# Altium schematic sheet buttons.SchDoc: Title
size B; Organization: Midnight Sun Solar Rayce Car Team; Address1: University of Waterloo; Address2: 200 University Ave W; Address3: Waterloo, ON, Canada; Address4: N2L 3E9; Website: www.uwmidsun.com; ProjectName: ProjectName
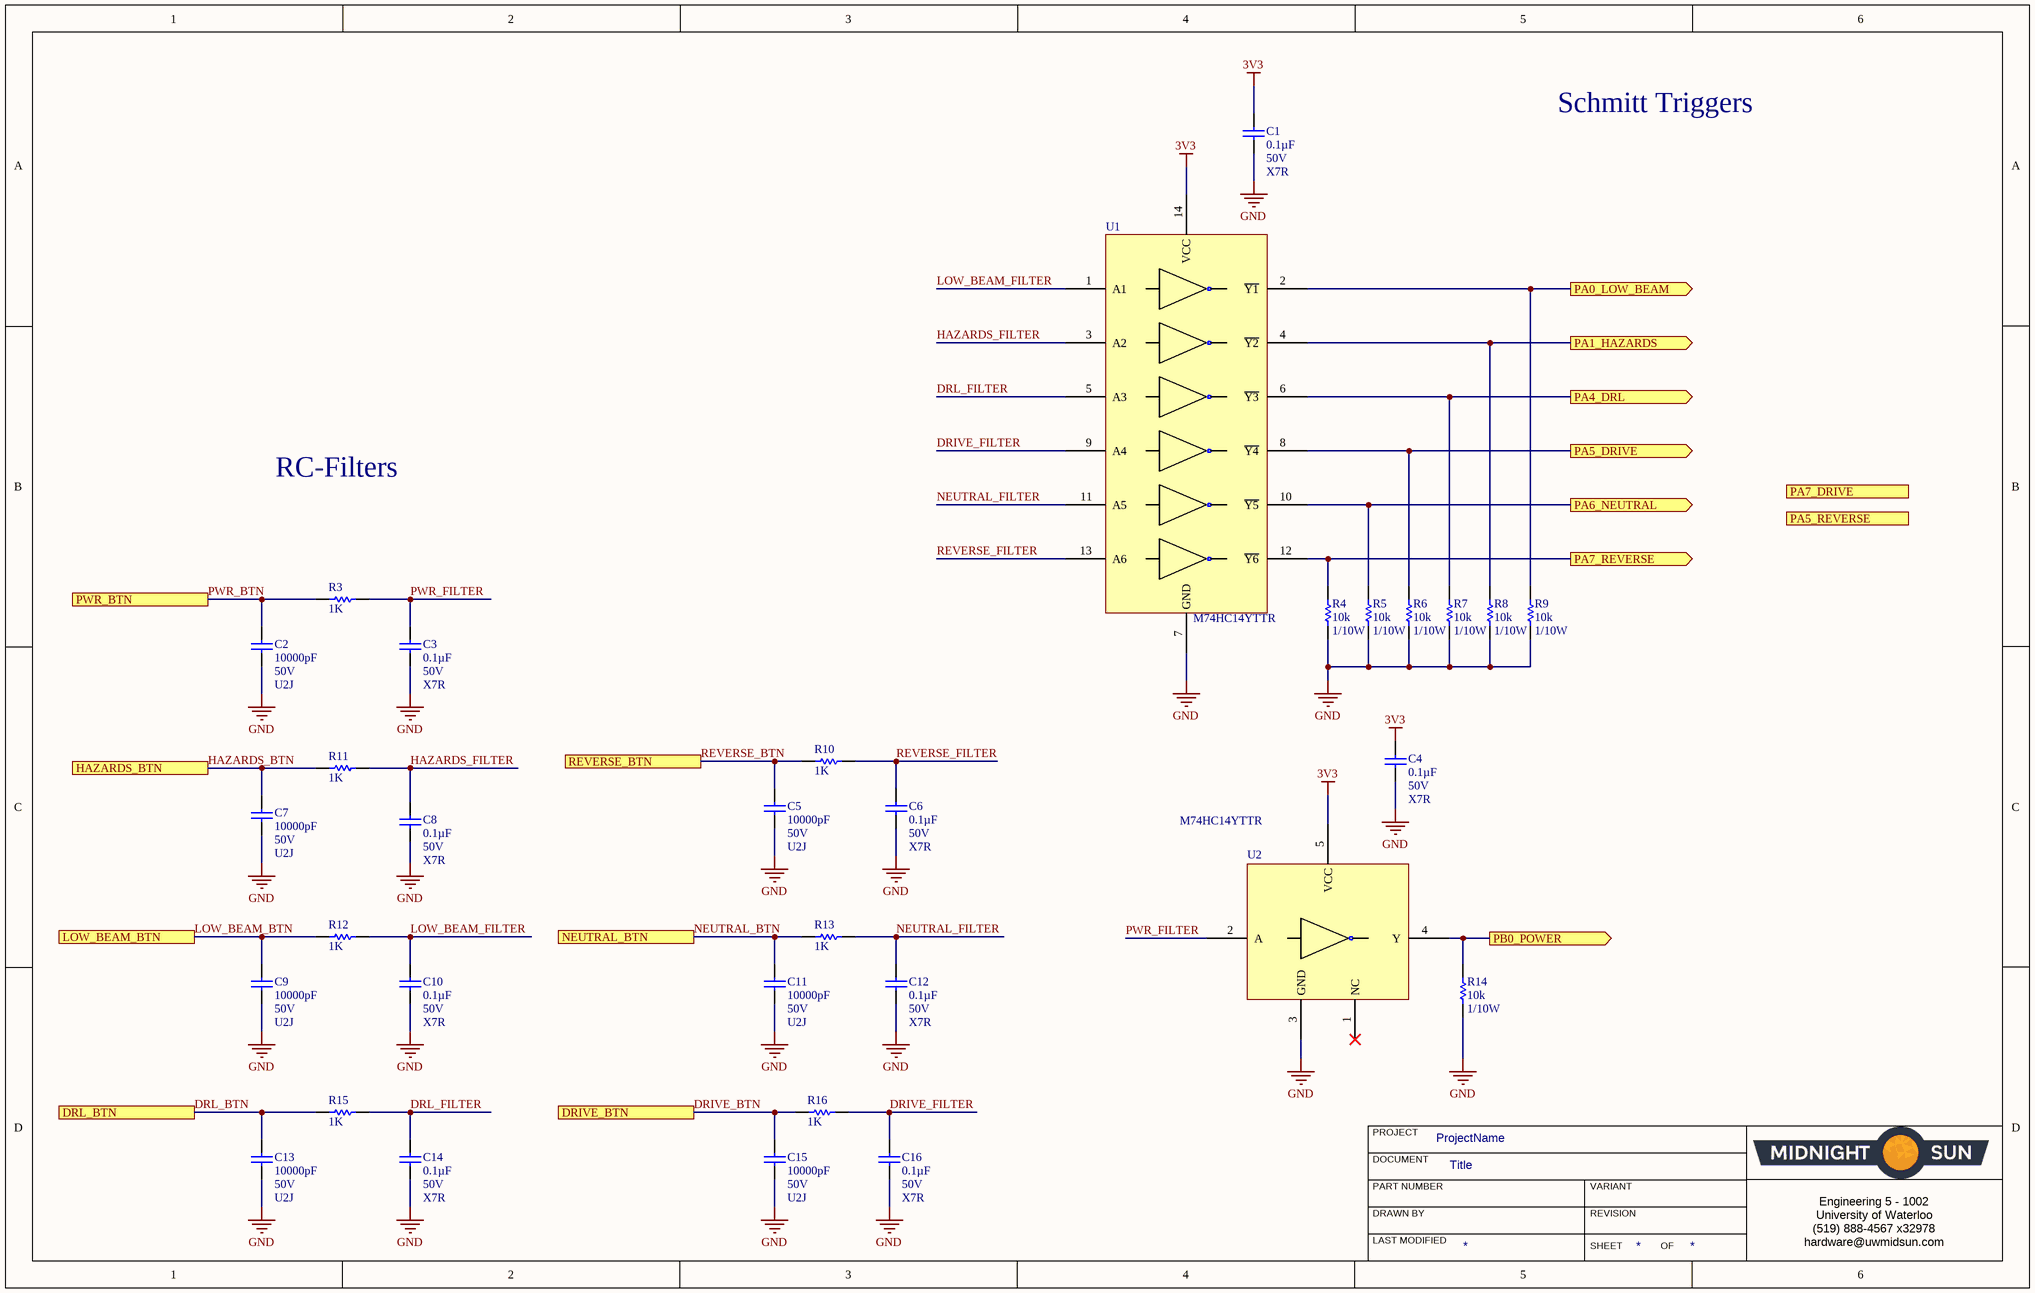
[diagram p0: buttons.SchDoc]

## Parts
C1  Capacitance: 0.1µF  Voltage: 50V  Temperature Coefficient: X7R  [CAP, 0603]  (hidden comment: CAP CER 0.1UF 50V 10% X7R 0603)
C2  Capacitance: 10000pF  Voltage: 50V  Temperature Coefficient: U2J  [CAP, 0603]  (hidden comment: CAP CER 10nF 50V 5% X7R 0603)
C3  Capacitance: 0.1µF  Voltage: 50V  Temperature Coefficient: X7R  [CAP, 0603]  (hidden comment: CAP CER 0.1UF 50V 10% X7R 0603)
C4  Capacitance: 0.1µF  Voltage: 50V  Temperature Coefficient: X7R  [CAP, 0603]  (hidden comment: CAP CER 0.1UF 50V 10% X7R 0603)
C5  Capacitance: 10000pF  Voltage: 50V  Temperature Coefficient: U2J  [CAP, 0603]  (hidden comment: CAP CER 10nF 50V 5% X7R 0603)
C6  Capacitance: 0.1µF  Voltage: 50V  Temperature Coefficient: X7R  [CAP, 0603]  (hidden comment: CAP CER 0.1UF 50V 10% X7R 0603)
C7  Capacitance: 10000pF  Voltage: 50V  Temperature Coefficient: U2J  [CAP, 0603]  (hidden comment: CAP CER 10nF 50V 5% X7R 0603)
C8  Capacitance: 0.1µF  Voltage: 50V  Temperature Coefficient: X7R  [CAP, 0603]  (hidden comment: CAP CER 0.1UF 50V 10% X7R 0603)
C9  Capacitance: 10000pF  Voltage: 50V  Temperature Coefficient: U2J  [CAP, 0603]  (hidden comment: CAP CER 10nF 50V 5% X7R 0603)
C10  Capacitance: 0.1µF  Voltage: 50V  Temperature Coefficient: X7R  [CAP, 0603]  (hidden comment: CAP CER 0.1UF 50V 10% X7R 0603)
C11  Capacitance: 10000pF  Voltage: 50V  Temperature Coefficient: U2J  [CAP, 0603]  (hidden comment: CAP CER 10nF 50V 5% X7R 0603)
C12  Capacitance: 0.1µF  Voltage: 50V  Temperature Coefficient: X7R  [CAP, 0603]  (hidden comment: CAP CER 0.1UF 50V 10% X7R 0603)
C13  Capacitance: 10000pF  Voltage: 50V  Temperature Coefficient: U2J  [CAP, 0603]  (hidden comment: CAP CER 10nF 50V 5% X7R 0603)
C14  Capacitance: 0.1µF  Voltage: 50V  Temperature Coefficient: X7R  [CAP, 0603]  (hidden comment: CAP CER 0.1UF 50V 10% X7R 0603)
C15  Capacitance: 10000pF  Voltage: 50V  Temperature Coefficient: U2J  [CAP, 0603]  (hidden comment: CAP CER 10nF 50V 5% X7R 0603)
C16  Capacitance: 0.1µF  Voltage: 50V  Temperature Coefficient: X7R  [CAP, 0603]  (hidden comment: CAP CER 0.1UF 50V 10% X7R 0603)
R3  1K  [RES, 0603]
R4  Resistance: 10k  Power: 1/10W  [RES, 0603]  (hidden comment: RES 10K OHM 1% 1/10W 0603)
R5  Resistance: 10k  Power: 1/10W  [RES, 0603]  (hidden comment: RES 10K OHM 1% 1/10W 0603)
R6  Resistance: 10k  Power: 1/10W  [RES, 0603]  (hidden comment: RES 10K OHM 1% 1/10W 0603)
R7  Resistance: 10k  Power: 1/10W  [RES, 0603]  (hidden comment: RES 10K OHM 1% 1/10W 0603)
R8  Resistance: 10k  Power: 1/10W  [RES, 0603]  (hidden comment: RES 10K OHM 1% 1/10W 0603)
R9  Resistance: 10k  Power: 1/10W  [RES, 0603]  (hidden comment: RES 10K OHM 1% 1/10W 0603)
R10  1K  [RES, 0603]
R11  1K  [RES, 0603]
R12  1K  [RES, 0603]
R13  1K  [RES, 0603]
R14  Resistance: 10k  Power: 1/10W  [RES, 0603]  (hidden comment: RES 10K OHM 1% 1/10W 0603)
R15  1K  [RES, 0603]
R16  1K  [RES, 0603]
U1  Manufacturer Part Number: M74HC14YTTR  [IC INVERTER SCHMITT 6CH 14TSSOP]  (hidden comment: IC INVERTER SCHMITT 6CH 14TSSOP)
U2  Manufacturer Part Number: M74HC14YTTR  [IC INVERTER SCHMITT 1CH SC70-5]  (hidden comment: IC INVERTER SCHMITT 1CH SC70-5)

## Ports
DRIVE_BTN, DRL_BTN, HAZARDS_BTN, LOW_BEAM_BTN, NEUTRAL_BTN, PA0_LOW_BEAM (out), PA1_HAZARDS (out), PA4_DRL (out), PA5_DRIVE (out), PA5_REVERSE (in), PA6_NEUTRAL (out), PA7_DRIVE (in), PA7_REVERSE (out), PB0_POWER (out), PWR_BTN, REVERSE_BTN

## Nets
3V3: C1.1 C4.1 U1.14(VCC) U2.5(VCC)
GND: C1.2 C2.2 C3.2 C4.2 C5.2 C6.2 C7.2 C8.2 C9.2 C10.2 C11.2 C12.2 C13.2 C14.2 C15.2 C16.2 R4.2 R5.2 R6.2 R7.2 R8.2 R9.2 R14.2 U1.7(GND) U2.3(GND)
DRIVE_BTN: C15.1 R16.1 ; port DRIVE_BTN
DRIVE_FILTER: C16.1 R16.2 U1.9(A4)
DRL_BTN: C13.1 R15.1 ; port DRL_BTN
DRL_FILTER: C14.1 R15.2 U1.5(A3)
HAZARDS_BTN: C7.1 R11.1 ; port HAZARDS_BTN
HAZARDS_FILTER: C8.1 R11.2 U1.3(A2)
LOW_BEAM_BTN: C9.1 R12.1 ; port LOW_BEAM_BTN
LOW_BEAM_FILTER: C10.1 R12.2 U1.1(A1)
NEUTRAL_BTN: C11.1 R13.1 ; port NEUTRAL_BTN
NEUTRAL_FILTER: C12.1 R13.2 U1.11(A5)
PA0_LOW_BEAM: R9.1 U1.2(~{Y1}) ; port PA0_LOW_BEAM
PA1_HAZARDS: R8.1 U1.4(~{Y2}) ; port PA1_HAZARDS
PA4_DRL: R7.1 U1.6(~{Y3}) ; port PA4_DRL
PA5_DRIVE: R6.1 U1.8(~{Y4}) ; port PA5_DRIVE
PA6_NEUTRAL: R5.1 U1.10(~{Y5}) ; port PA6_NEUTRAL
PA7_REVERSE: R4.1 U1.12(~{Y6}) ; port PA7_REVERSE
PB0_POWER: R14.1 U2.4(Y) ; port PB0_POWER
PWR_BTN: C2.1 R3.1 ; port PWR_BTN
PWR_FILTER: C3.1 R3.2 U2.2(A)
REVERSE_BTN: C5.1 R10.1 ; port REVERSE_BTN
REVERSE_FILTER: C6.1 R10.2 U1.13(A6)

Not connected (* = marked no-connect by the designer): U2 1(NC)*

## Notes on the sheet
- Schmitt Triggers
- RC-Filters
- PROJECT
- DOCUMENT
- DRAWN BY
- LAST MODIFIED
- PART NUMBER
- REVISION
- SHEET
- VARIANT
- OF
- Engineering 5 - 1002
  University of Waterloo
  (519) 888-4567 x32978
  hardware@uwmidsun.com

## Library data of the parts
C1 C3 C4 C6 C8 C10 C12 C14 C16 = CAP CER 0.1UF 50V 10% X7R 0603: 0.10µF ±10% 50V Ceramic Capacitor X7R 0603 (1608 Metric); Manufacturer 1: AVX Corporation; Manufacturer Part Number 1: 06035C104KAT2A; Supplier 1: Digi-Key; Supplier Part Number 1: 478-5052-1-ND; Packaging: Cut Tape (CT); Part Status: Active; Operating Temperature: -55°C ~ 125°C; Ratings: -; Mounting Type: Surface Mount, MLCC; Package / Case: 0603 (1608 Metric); Size / Dimension: 0.063" L x 0.032" W (1.60mm x 0.81mm); Height - Seated (Max): -; Thickness (Max): 0.035" (0.90mm); Lead Spacing: -; Lead Style: -; ComponentLink1URL: http://datasheets.avx.com/X7RDielectric.pdf; ComponentLink1Description: http://datasheets.avx.com/X7RDielectric.pdf; Tolerance: ±10%
C2 C5 C7 C9 C11 C13 C15 = CAP CER 10nF 50V 5% X7R 0603: 10000pF ±5% 50V Ceramic Capacitor U2J 0603 (1608 Metric); Manufacturer 1: KEMET; Manufacturer Part Number 1: C0603C103J5JAC7867; Supplier 1: Digi-Key; Supplier Part Number 1: 399-13384-1-ND; Packaging: Cut Tape (CT); Part Status: Active; Operating Temperature: -55°C ~ 125°C; Ratings: -; Failure Rate: -; Mounting Type: Surface Mount, MLCC; Package / Case: 0603 (1608 Metric); Size / Dimension: 0.063" L x 0.032" W (1.60mm x 0.80mm); Height - Seated (Max): -; Thickness (Max): 0.034" (0.87mm); Lead Spacing: -; Lead Style: -; ComponentLink1URL: http://www.kemet.com/docfinder?Partnumber=C0603C103J5JAC7867; ComponentLink1Description: http://www.kemet.com/docfinder?Partnumber=C0603C103J5JAC7867; Tolerance: ±5%
R3 R10-R13 R15 R16 = RES 1K OHM 5% 1/10W 0603: 1k Ohm ±5% 0.1W, 1/10W Chip Resistor 0603 (1608 Metric); Manufacturer: Yageo; Manufacturer Part Number: RC0603JR-071KL; Temperature Coefficient: ±100ppm/°C; Supplier 1: Digi-Key; Supplier Part Number 1: 311-1.0KGRCT-ND; RoHS: RoHS Compliant; Category: Resistors; Stock 1: 4415240; Pricing 1: 1=0.15, 10=0.017, 100=0.0071, 1000=0.0032, 2500=0.00278 (CAD); Packaging: Cut Tape (CT); Part Status: Active; Resistance (Ohms): 1k; Tolerance: ±5%; Power (Watts): 0.1W, 1/10W; Composition: Thick Film; Features: Moisture Resistant; Operating Temperature: -55°C ~ 155°C; Package / Case: 0603 (1608 Metric); Supplier Device Package: 0603; Size / Dimension: 0.063" L x 0.031" W (1.60mm x 0.80mm); Height - Seated (Max): 0.022" (0.55mm); Failure Rate: -; ComponentLink1URL: http://www.yageo.com/documents/recent/PYu-RC_Group_51_RoHS_L_7.pdf; ComponentLink1Description: http://www.yageo.com/documents/recent/PYu-RC_Group_51_RoHS_L_7.pdf
R4-R9 R14 = RES 10K OHM 1% 1/10W 0603: RES SMD 10K OHM 1% 1/10W 0603; Manufacturer 1: Yageo; Manufacturer Part Number 1: RC0603FR-0710KL; Temperature Coefficient: ±100ppm/°C; Supplier 1: Digi-Key; Supplier Part Number 1: 311-10.0KHRCT-ND; Packaging: Cut Tape (CT); Part Status: Active; Composition: Thick Film; Operating Temperature: -55°C ~ 155°C; Package / Case: 0603 (1608 Metric); Supplier Device Package: 0603; Size / Dimension: 0.063" L x 0.031" W (1.60mm x 0.80mm); Height - Seated (Max): 0.022" (0.55mm); Failure Rate: -; ComponentLink1URL: http://www.yageo.com/documents/recent/PYu-RC_Group_51_RoHS_L_7.pdf; ComponentLink1Description: http://www.yageo.com/documents/recent/PYu-RC_Group_51_RoHS_L_7.pdf; Tolerance: ±1%
U1 = IC INVERTER SCHMITT 6CH 14TSSOP: Inverter IC 6 Channel Schmitt Trigger 14-TSSOP; Manufacturer: STMicroelectronics; Number of Inputs: 6; Propagation Delay: 21ns; Max Supply Voltage: 6V; Min Supply Voltage: 2V; Quiescent Current: 1uA; High Level Output Current: 5.2mA; Turn-On Delay Time: 25ns; ComponentLink1Description: Digikey; ComponentLink1URL: https://www.digikey.ca/product-detail/en/stmicroelectronics/M74HC14YTTR/497-14387-1-ND/4725844; Supplier 1: Digi-Key; RoHS: Yes; Stock 1: 20035; Pricing 1: 1 = 0.44000, 10 = 0.37500, 100 = 0.27970, 500 = 0.21980, 1000 = 0.16985 (USD); Mount: Surface Mount; Case/Package: TSSOP; Number of Pins: 14; Weight: 0.004949oz; Min Operating Temperature: -40°C; Max Operating Temperature: 125°C; Packaging: Tape and Reel; Package Quantity: 2500; Logic Function: Inverter; Number of Circuits: 6; Low Level Output Current: 5.2mA; Lead Free: Lead Free; ComponentLink2URL: http://www.st.com/content/ccc/resource/technical/document/datasheet/19/a3/52/42/dd/ab/4b/46/CD00000263.pdf/files/CD00000263.pdf/jcr:content/translations/en.CD00000263.pdf; ComponentLink2Description: http://www.st.com/content/ccc/resource/technical/document/datasheet/19/a3/52/42/dd/ab/4b/46/CD00000263.pdf/files/CD00000263.pdf/jcr:content/translations/en.CD00000263.pdf; ComponentLink3URL: http://www.st.com/st-web-ui/static/active/en/resource/technical/document/datasheet/CD00000263.pdf; ComponentLink3Description: http://www.st.com/st-web-ui/static/active/en/resource/technical/document/datasheet/CD00000263.pdf; Supplier Part Number 1: 497-14387-1-ND
U2 = IC INVERTER SCHMITT 1CH SC70-5: Inverter IC 1 Channel Schmitt Trigger SC-70-5; Manufacturer: STMicroelectronics; Number of Inputs: 6; Propagation Delay: 21ns; Max Supply Voltage: 6V; Min Supply Voltage: 2V; Quiescent Current: 1uA; High Level Output Current: 5.2mA; Turn-On Delay Time: 25ns; Number of Bits: 1; RoHS: Yes; Mount: Surface Mount; Case/Package: TSSOP; Number of Pins: 14; Weight: 0.004949oz; Min Operating Temperature: -40°C; Max Operating Temperature: 125°C; Packaging: Tape and Reel; Package Quantity: 2500; Logic Function: Inverter; Number of Circuits: 6; Low Level Output Current: 5.2mA; Lead Free: Lead Free; Supplier 1: Digi-Key; Stock 1: 11031; Pricing 1: 1 = 0.36000, 10 = 0.29000, 100 = 0.19780, 500 = 0.14832, 1000 = 0.11124 (USD); Supplier Part Number 1: 296-47215-1-ND